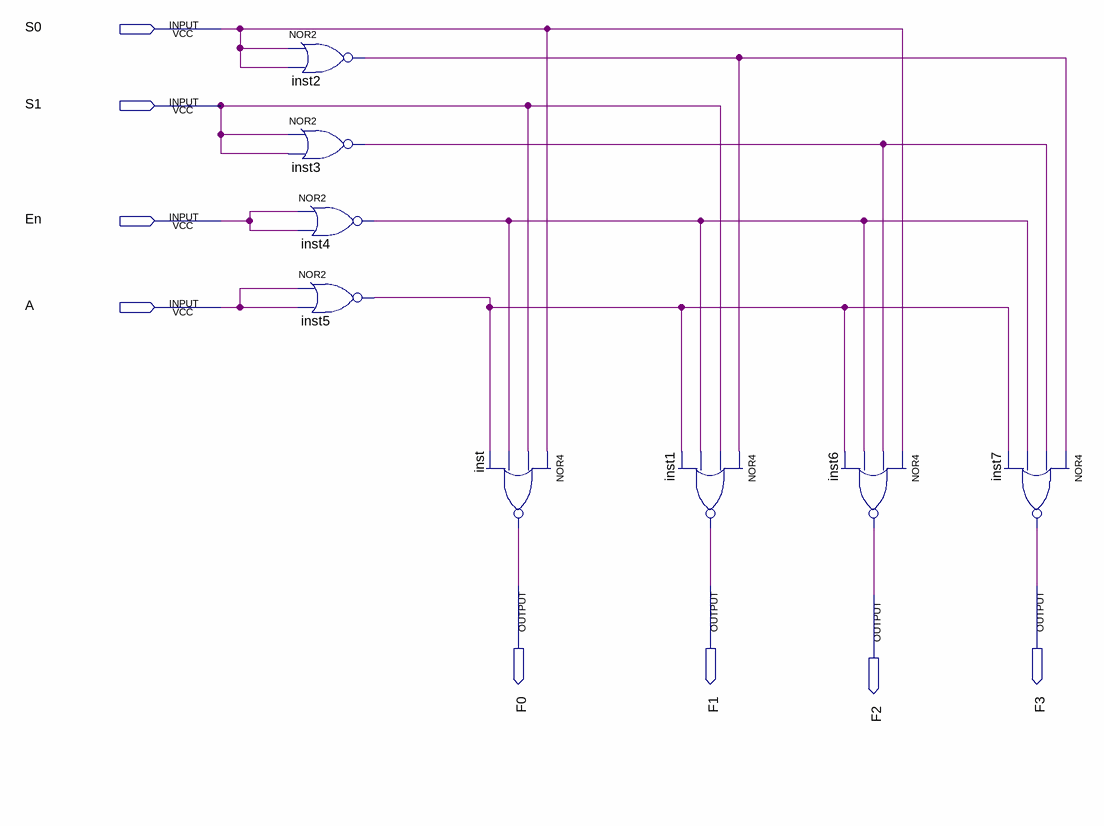
[diagram p0: schematic sheet]
// Quartus schematic q1.bdf as structural Verilog: 8 symbols, 8 pins
module q1 (
  input  S0,
  input  S1,
  input  En,
  input  A,
  output F0,
  output F1,
  output F3,
  output F2
);

  wire inst2_out, inst3_out, inst4_out, inst5_out;

  nor inst2 (inst2_out, S0, S0);
  nor inst3 (inst3_out, S1, S1);
  nor inst4 (inst4_out, En, En);
  nor inst5 (inst5_out, A, A);
  nor inst (F0, S0, S1, inst4_out, inst5_out);
  nor inst1 (F1, inst2_out, S1, inst4_out, inst5_out);
  nor inst6 (F2, S0, inst3_out, inst4_out, inst5_out);
  nor inst7 (F3, inst2_out, inst3_out, inst4_out, inst5_out);
endmodule
